# EasyEDA Pro project ProPrj_My_FOC_DRV8313_Share.epro

# Schematic Schematic2
Board Name: Board2; Create Date: 2024-11-29; Page Name: P1; Project Name: My_FOC_DRV8313; Schematic Name: Schematic2; Update Date: 2024-11-29; Company: 嘉立创EDA; Page Size: A3; Version: V1.0
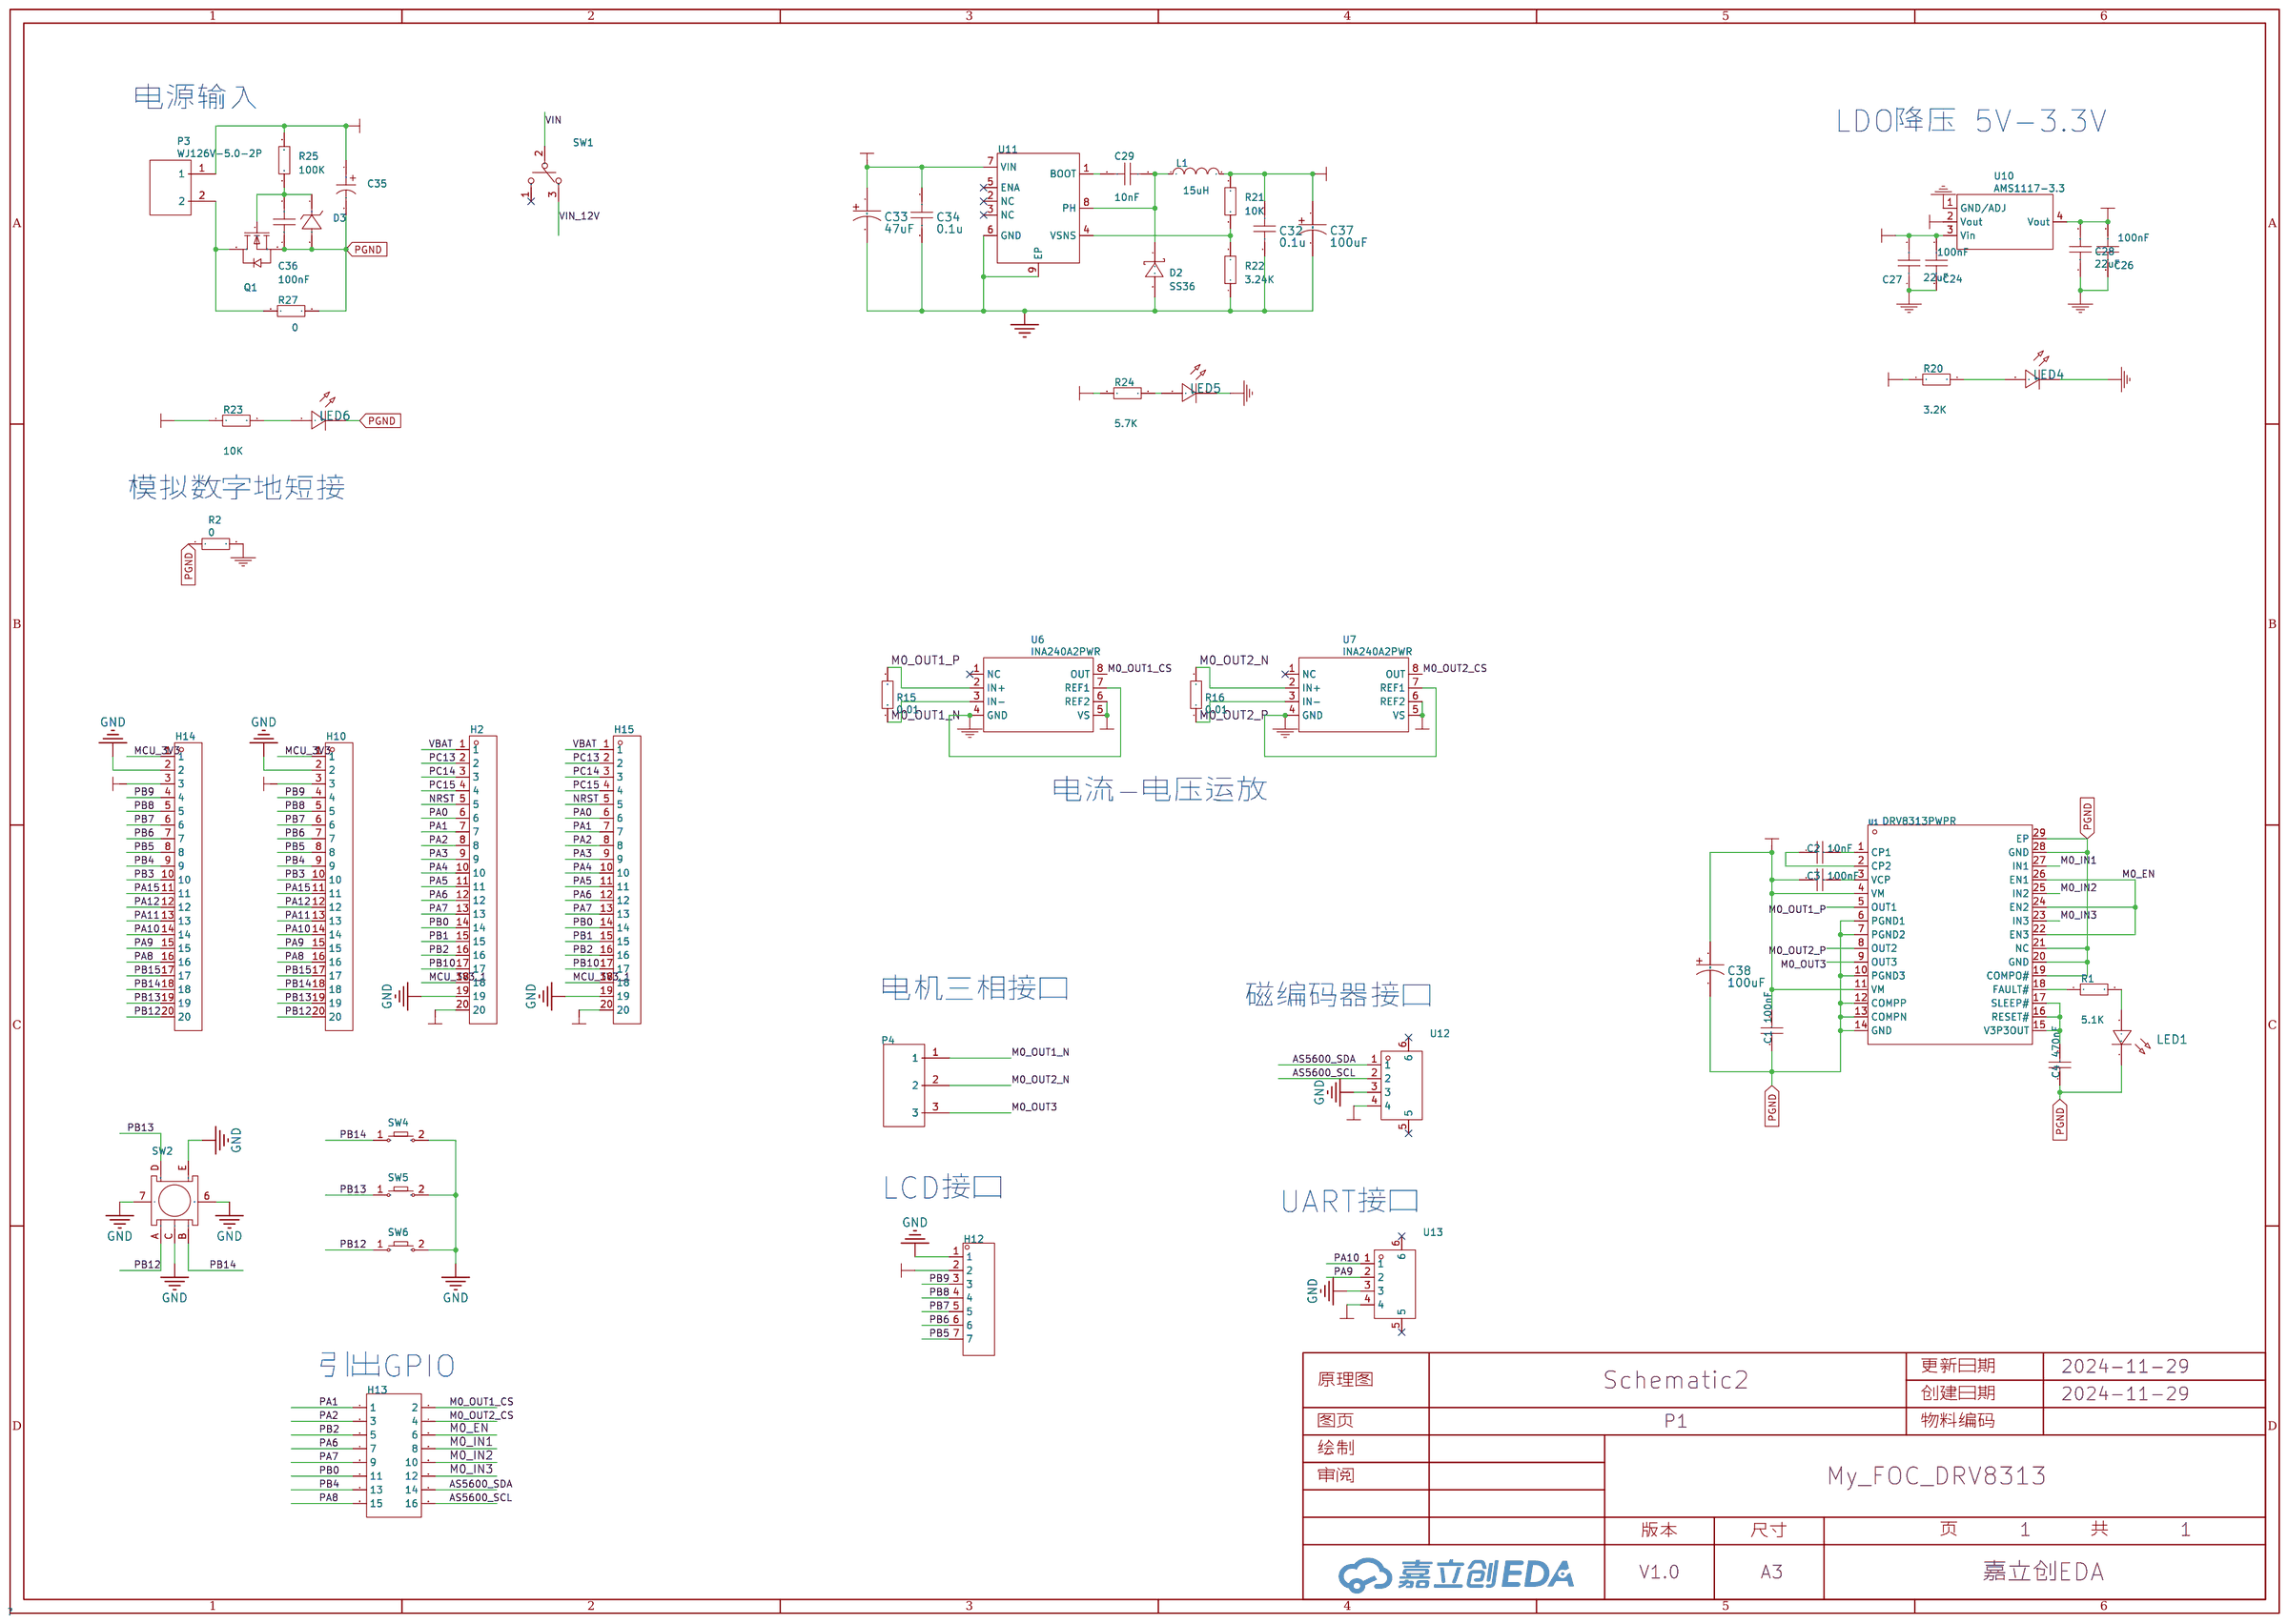
[diagram p0: schematic sheet]

## Parts
C1  100nF  [C0603]
C2  10nF  [C0603]
C3  100nF  [C0603]
C4  470nF  [C0603]
C24  100nF  [C0603]
C26  100nF  [C0603]
C27  22uF  [C0603]
C28  22uF  [C0603]
C29  10nF  [C0603]
C32  0.1u  [C0603]
C33  47uF  [CAP-SMD_BD5.0-L5.3-W5.3-FD]
C34  0.1u  [C0603]
C35  LZ1C471M0810  [CAP-SMD_BD8.0-L8.3-W8.3-LS9.3-FD-2]
C36  100nF  [C0603]
C37  100uF  [CAP-SMD_BD5.0-L5.3-W5.3-FD]
C38  100uF  [CAP-SMD_BD5.0-L5.3-W5.3-FD]
D2  SS36  [SMA_L4.3-W2.6-LS5.2-RD]
D3  ZMM12  [LL-34_L3.5-W1.5-RD]
H2  -  [HDR-TH_20P-P2.54-V-M-1]
H10  -  [HDR-TH_20P-P2.54-V-M-1]
H12  -  [HDR-TH_7P-P2.54-V-F]
H13  -  [HDR-TH_16P-P2.54-V-F-R2-C8-S2.54-1]
H14  -  [HDR-TH_20P-P2.54-V-M-1]
H15  -  [HDR-TH_20P-P2.54-V-M-1]
L1  15uH  [IND-SMD_L4.0-W4.0]
LED1  -  [LED_0603]
LED4  -  [LED_0603]
LED5  -  [LED_0603]
LED6  -  [LED_0603]
P3  WJ126V-5.0-2P  [conn-th_wj126v-5.0-2p]
P4  WJ126V-5.0-3P  [CONN-TH_3P-P5.00_WJ126V-5.0-3P]
Q1  AO3400A  [SOT-23-3_L2.9-W1.3-P1.90-LS2.4-BR]
R1  5.1K  [R0603]
R2  0  [R0805]
R15  0.01  [R1206]
R16  0.01  [R1206]
R20  3.2K  [R0603]
R21  10K  [R0603]
R22  3.24K  [R0603]
R23  10K  [R0603]
R24  5.7K  [R0603]
R25  100K  [R0603]
R27  0  [R0805]
SW1  MT-0-103-A101-M200-RS  [SW-TH_MT-0-103-A101-M200-RS]
SW2  EC11E15244G1  [SW-TH_EC11E15244G1]
SW4  -  [Key_SMD_3.6x6.1x2.5]
SW5  -  [Key_SMD_3.6x6.1x2.5]
SW6  -  [Key_SMD_3.6x6.1x2.5]
U1  DRV8313PWPR  [HTSSOP-28_L9.8-W4.5-P0.65-LS6.6-BL-EP]
U6  INA240A2PWR  [TSSOP-8_L4.4-W3.0-P0.65-LS6.4-BL]
U7  INA240A2PWR  [TSSOP-8_L4.4-W3.0-P0.65-LS6.4-BL]
U10  AMS1117-3.3  [SOT-223-3_L6.5-W3.4-P2.30-LS7.0-BR]
U11  TPS5430DDA  [ESOP-8_L4.9-W3.9-P1.27-LS6.0-BL-EP-2]
U12  XY-PH2.0-4A61  [CONN-SMD_4P-P2.00_XYECONN_XY-PH2.0-4A61]
U13  XY-PH2.0-4A61  [CONN-SMD_4P-P2.00_XYECONN_XY-PH2.0-4A61]

## Library data of the parts
C1 C3 = 0603B104K500NT: 容值:100nF;精度:±10%;额定电压:50V;材质(温度系数):X7R;; LCSC Part Name: 100nF ±10% 50V; Supplier Part: C30926; Manufacturer: FH(风华); Supplier Footprint: 0603; JLCPCB Part Class: Extended Part; Datasheet: https://atta.szlcsc.com/upload/public/pdf/source/20200305/C486355_26A10D38EF8C2A5C37091D0039909270.pdf; Supplier: LCSC; Tolerance: ±10%; Voltage Rated: 50V; Temperature Coefficient: X7R
C2 = CC0603KRX7R9BB103: 容值:10nF;精度:±10%;额定电压:50V;材质(温度系数):X7R;; LCSC Part Name: 10nF ±10% 50V; Supplier Part: C100042; Manufacturer: YAGEO(国巨); Supplier Footprint: 0603; JLCPCB Part Class: 扩展库; Datasheet: https://atta.szlcsc.com/upload/public/pdf/source/20181008/C309510_22F155564471FAF6A489F7D68F34234E.pdf; Supplier: LCSC; Tolerance: ±10%; Voltage Rated: 50V; Temperature Coefficient: X7R
C4 = CL10B474KA8NNNC: 容值:470nF;精度:±10%;额定电压:25V;材质(温度系数):X7R;; LCSC Part Name: 470nF ±10% 25V; Supplier Part: C1623; Manufacturer: SAMSUNG(三星); Supplier Footprint: 0603; JLCPCB Part Class: Basic Part; Datasheet: https://atta.szlcsc.com/upload/public/pdf/source/20160218/1457707763339.pdf; Supplier: LCSC; Tolerance: ±10%; Voltage Rated: 25V; Temperature Coefficient: X7R
C24 C26 = CC0603KRX7R9BB104: Supplier: LCSC; Manufacturer: YAGEO; Supplier Part: C14663; JLCPCB Part Class: Basic; JLCPCB SMD: Yes
C27 C28 = CL10A226MQ8NRNC: Supplier: LCSC; Manufacturer: SAMSUNG; Supplier Part: C59461; Paste Type: base
C29 C36 = CAP_0603: Supplier Footprint: 0603
C32 C34 = 0.1u
C33 C37 C38 = FVH016ADA470M0554: 容值:47uF;精度:±20%;额定电压:16V;; LCSC Part Name: 47uF ±20% 16V; Supplier Part: C7469972; Manufacturer: FOSAN(富信); Supplier Footprint: 5x5.4; JLCPCB Part Class: Extended Part; Datasheet: https://atta.szlcsc.com/upload/public/pdf/source/20230725/F0E937D26738F08AA89B969080CCF08D.pdf; Supplier: LCSC; Tolerance: ±20%; Rated Voltage: 16V; Operating Temperature: -55℃~+105℃
C35 = LZ1C471M0810: 容值: 470uF 精度: ±20% 额定电压: 16V 电容直径: 8mm 电容高度: 10.5mm 工作温度: 2000H@105℃贴片型铝电解电容; LCSC Part Name: 470uF ±20% 16V; Supplier Part: C22396804; Manufacturer: JARSON(伽盛); Supplier Footprint: SMD,8x10.5mm; JLCPCB Part Class: 扩展库; Datasheet: https://atta.szlcsc.com/upload/public/pdf/source/20240511/2B49156F673E82F822B79B11C5695630.pdf; Supplier: LCSC
D2 = SS36: Supplier: LCSC; Manufacturer: MDD; image: //image.lceda.cn/szlcsc/C16015.jpg; Supplier Part: C16015; Paste Type: expand
D3 = ZMM12_C707203: 稳压值(标称值):-;功率(Pd):500mW;; Supplier Part: C707203; Manufacturer: Slkor(萨科微); Supplier Footprint: LL-34; JLCPCB Part Class: 扩展库; Datasheet: https://atta.szlcsc.com/upload/public/pdf/source/20200721/C707184_776B95022AAA01ECB528B9CFDAFDB27C.pdf; Supplier: LCSC; Reverse Leakage Current (Ir): 100nA@9.1V; Power Dissipation: 500mW
H2 H10 H14 H15 = HDR-M_2.54_1x20P: 间距:2.54mm;总PIN位数:20;排数:1;插针结构:-;行距:-;安装类型:直插;圆针/方针:-;额定电流:-;额定电压:-;配合针长度:-;塑高:-;触头材质:黄铜;触头镀层:-;颜色:黑色;; Supplier Part: C50981; Supplier Footprint: 插件
H12 = HDR-F_2.54_1x7P: Supplier Part: C124418; Supplier Footprint: 插件
H13 = HDR-F_2.54_2x8: Supplier Part: C30734; Supplier Footprint: 插件
L1 = SWPA4018S100MT: 电感值:10uH;精度:±20%;额定电流:840mA;饱和电流(Isat):1.6A;类型:-;; LCSC Part Name: 10uH ±20% 1.6A; Supplier Part: C83442; Manufacturer: Sunlord(顺络); Supplier Footprint: SMD; JLCPCB Part Class: 扩展库; Datasheet: https://atta.szlcsc.com/upload/public/pdf/source/20231024/317626D2AA2F8AB4113C1875E432E6E1.pdf; Supplier: LCSC; Tolerance: ±20%; Rated Current: 840mA; Saturation Current (Isat): 1.6A; DC Resistance (DCR): 234mΩ
LED1 LED4-LED6 = LED_0603-R: Supplier Footprint: 0603
P3 = WJ126V-5.0-2P: Supplier: LCSC; Manufacturer: ReliaPro; Supplier Part: C8404; JLCPCB Part Class: Extended Part
P4 = WJ126V-5.0-3P: 结构:1x3P;间距:5mm;颜色:绿色;安装方式:直插;额定电流:18A;额定电压:250V;排数:1;线规 - AWG:14~26;线规 - 平方毫米:2.5;每排PIN数:3;工作温度范围:-40℃~+105℃;; LCSC Part Name: 5mm 1x3P 排数:1 每排P数:3 直插; Supplier Part: C8401; Manufacturer: KANGNEX(康奈克斯电气); Supplier Footprint: 插件,P=5mm; JLCPCB Part Class: 扩展库; Datasheet: https://atta.szlcsc.com/upload/public/pdf/source/20191225/C8401_BC4AEF85CCBF7CDF5CCE64583ADD1E63.pdf; Supplier: LCSC; Structure: 1x3P; Pitch: 5mm; Color: 绿色; Mounting Style: 直插; Current Rating (Max): 18A; Voltage Rating (Max): 250V; Number of Pins: 3P; Number of Rows: 1; Wire Gauge - AWG: 14~26; Wire Gauge - mm2: 2.5; Number of PINs Per Row: 3; Operating Temperature Range: -40℃~+105℃
Q1 = AO3400A_C347475: 类型:1个N沟道;漏源电压(Vdss):30V;连续漏极电流(Id):5.8A;导通电阻(RDS(on)@Vgs,Id):28mΩ@10V,5.8A;功率(Pd):1.4W;阈值电压(Vgs(th)@Id):1.4V@250uA;; LCSC Part Name: 1个N沟道 耐压:30V 电流:5.8A; Supplier Part: C347475; Manufacturer: UMW(友台半导体); Supplier Footprint: SOT-23; JLCPCB Part Class: 扩展库; Datasheet: https://atta.szlcsc.com/upload/public/pdf/source/20231109/50AB4FB4D66E55864F9B8D027B723C9A.pdf; Supplier: LCSC; Type: 1个N沟道; Drain Source Voltage (Vdss): 30V; Continuous Drain Current (Id): 5.8A; Drain Source On Resistance (RDS(on)@Vgs,Id): 28mΩ@10V,5.8A; Power Dissipation (Pd): 1.4W; Gate Threshold Voltage (Vgs(th)@Id): 1.4V@250uA; Total Gate Charge (Qg@Vgs): 12nC@10V; Input Capacitance (Ciss@Vds): 1.05nF@24V; Reverse Transfer Capacitance (Crss@Vds): 77pF@15V; Operating Temperature: -55℃~+150℃
R1 R20-R25 = Res_0603: Supplier Footprint: 0603
R2 = RM10FTN0: Supplier: LCSC; Supplier Part: C254574; Manufacturer: TA-I Tech
R15 R16 = RTT06R010FTP: Supplier: LCSC; Manufacturer: RALEC; Supplier Part: C104920
R27 = Res_0805: Supplier Footprint: 0805
SW1 = MT-0-103-A101-M200-RS: 电路结构:单刀双掷;机械寿命:-;额定电流:5A;额定电压(AC):125V;安装方式:直插;; LCSC Part Name: 小型钮子三脚三档 五件套 含配件; Supplier Part: C1788493; Manufacturer: YUEN FUNG(源丰); Supplier Footprint: 插件; JLCPCB Part Class: 扩展库; Datasheet: https://atta.szlcsc.com/upload/public/pdf/source/20230720/A7297B66510B798CA716A50870BE0E5B.pdf; Supplier: LCSC; Circuit: 单刀双掷; Switch Length: 13mm; Switch Width: 8mm; Switch Height: 28.6mm; Contact Current: 5A; Voltage Rating (AC): 125V; Actuator Type: 圆柱钮柄; Pin Style: 焊片; Mounting Style: 直插; Operating Temperature: -25℃~+85℃
SW2 = EC11E15244G1: LCSC Part Name: 编码器; Supplier Part: C370970; Manufacturer: ALPSALPINE(阿尔卑斯阿尔派); Supplier Footprint: 插件; JLCPCB Part Class: Extended Part; Datasheet: https://atta.szlcsc.com/upload/public/pdf/source/20190222/C370970_45D3DFC793E5CF6FACAF06DB9E7FAE9E.pdf; Supplier: LCSC
SW4-SW6 = Key_SMD_3.6x6.1x2.5: Supplier Footprint: SMD
U1 = DRV8313PWPR: 驱动电机类型:无刷直流BLDC;电源电压:8V~60V;输出电流:-;接口:并行;; LCSC Part Name: 无刷直流BLDC电机驱动芯片 60V; Supplier Part: C92482; Manufacturer: TI(德州仪器); Supplier Footprint: HTSSOP-28-EP-4.5mm; JLCPCB Part Class: 扩展库; Datasheet: https://www.ti.com/cn/lit/gpn/drv8313; Supplier: LCSC; Drive motor type: 无刷直流BLDC; Supply Voltage: 8V~60V; Interface: 并行; Operating Temperature: -40℃~+150℃@(Tj)
U6 U7 = INA240A2PWR: Supplier: LCSC; Manufacturer: TI; Supplier Part: C129949; Paste Type: expand
U10 = AMS1117-3.3: Supplier: LCSC; Manufacturer: AMS; image: //image.lceda.cn/szlcsc/C6186.jpg; Supplier Part: C6186; JLCPCB Part Class: Basic; JLCPCB SMD: Yes
U11 = TPS5430DDA: 功能类型:降压型;输出类型:可调;输入电压:5.5V~36V;输出电压:1.221V~32.04V;输出电流(最大值):3A;; LCSC Part Name: 降压 3A 36V; Supplier Part: C502477; Manufacturer: TI(德州仪器); Supplier Footprint: ESOP-8; JLCPCB Part Class: 扩展库; Datasheet: https://www.ti.com/cn/lit/gpn/tps5430; Supplier: LCSC; Function: 降压型; Output Type: 可调; Input Voltage: 5.5V~36V; Output Voltage: 1.221V~32.04V; Output Current (Max): 3A; Switching Frequency: 500kHz; Operating Temperature: -40℃~+125℃@(TJ); Synchronous Rectification: 否; Number of Outputs: 1; Topology: 降压式; Switch tube (built-in/external): 内置
U12 U13 = XY-PH2.0-4A61: 插针结构:1x4P;间距:2mm;安装方式:卧贴;总PIN数:4P;排数:1;每排PIN数:4;; LCSC Part Name: 间距:2.0mm 1x4P 卧贴; Supplier Part: C19272097; Manufacturer: XYECONN(辛译); Supplier Footprint: SMD,P=2mm,卧贴; JLCPCB Part Class: Extended Part; Datasheet: https://atta.szlcsc.com/upload/public/pdf/source/20231128/F1F74D25EE41EDF9A689EFC57C64BCC7.pdf; Supplier: LCSC; Pins Structure: 1x4P; Pitch: 2mm; Mounting Style: 卧贴; Number of Pins: 4P; Number of Rows: 1; Number of PINs Per Row: 4

## Nets
GND: C24.2 C26.2 C27.1 C28.1 C32.2 C33.2 C34.2 C37.2 D2.2(A) H2.19 H10.2 H12.1 H14.2 H15.19 LED4.1(C) LED5.1(C) R2.2 R22.1 SW2.6 SW2.7 SW2.C SW2.E SW4.2 SW5.2 SW6.2 U6.4(GND) U6.7(REF1) U7.4(GND) U7.7(REF1) U10.1(GND/ADJ) U11.6(GND) U11.9(EP) U12.3 U13.3
PGND: C1.1 C4.1 C35.2 C36.1 C38.2 D3.2(A) LED1.1(C) LED6.1(C) Q1.2(S) R2.1 R27.2 U1.6(PGND1) U1.7(PGND2) U1.10(PGND3) U1.12(COMPP) U1.13(COMPN) U1.14(GND) U1.19(COMPO#) U1.20(GND) U1.21(NC) U1.28(GND) U1.29(EP)
VBAT: H2.1 H15.1
VCC-3.3V: C26.1 C28.2 H12.2 R20.1 U6.5(VS) U6.6(REF2) U7.5(VS) U7.6(REF2) U10.2(Vout) U10.4(Vout) U12.4 U13.4
VCC-5V: C24.1 C27.2 C32.1 C37.1 H10.3 H14.3 L1.2 R21.2 R24.1 U10.3(Vin)
VIN: C1.2 C3.1 C33.1 C34.1 C38.1 R23.1 SW1.2 U1.4(VM) U1.11(VM) U11.7(VIN)
VIN_12V: C35.1 P3.1 R25.2 SW1.3
AS5600_SCL: H13.16 U12.2
AS5600_SDA: H13.14 U12.1
M0_EN: H13.6 U1.22(EN3) U1.24(EN2) U1.26(EN1)
M0_IN1: H13.8 U1.27(IN1)
M0_IN2: H13.10 U1.25(IN2)
M0_IN3: H13.12 U1.23(IN3)
M0_OUT1_CS: H13.2 U6.8(OUT)
M0_OUT1_N: P4.1 R15.1 U6.3(IN-)
M0_OUT1_P: R15.2 U1.5(OUT1) U6.2(IN+)
M0_OUT2_CS: H13.4 U7.8(OUT)
M0_OUT2_N: P4.2 R16.2 U7.2(IN+)
M0_OUT2_P: R16.1 U1.8(OUT2) U7.3(IN-)
M0_OUT3: P4.3 U1.9(OUT3)
MCU_3V3: H10.1 H14.1
MCU_3V3_1: H2.18 H15.18
MCU_5V: H2.20 H15.20
NRST: H2.5 H15.5
PA0: H2.6 H15.6
PA1: H2.7 H13.1 H15.7
PA2: H2.8 H13.3 H15.8
PA3: H2.9 H15.9
PA4: H2.10 H15.10
PA5: H2.11 H15.11
PA6: H2.12 H13.7 H15.12
PA7: H2.13 H13.9 H15.13
PA8: H10.16 H13.15 H14.16
PA9: H10.15 H14.15 U13.2
PA10: H10.14 H14.14 U13.1
PA11: H10.13 H14.13
PA12: H10.12 H14.12
PA15: H10.11 H14.11
PB0: H2.14 H13.11 H15.14
PB1: H2.15 H15.15
PB2: H2.16 H13.5 H15.16
PB3: H10.10 H14.10
PB4: H10.9 H13.13 H14.9
PB5: H10.8 H12.7 H14.8
PB6: H10.7 H12.6 H14.7
PB7: H10.6 H12.5 H14.6
PB8: H10.5 H12.4 H14.5
PB9: H10.4 H12.3 H14.4
PB10: H2.17 H15.17
PB12: H10.20 H14.20 SW2.A SW6.1
PB13: H10.19 H14.19 SW2.D SW5.1
PB14: H10.18 H14.18 SW2.B SW4.1
PB15: H10.17 H14.17
PC13: H2.2 H15.2
PC14: H2.3 H15.3
PC15: H2.4 H15.4
$1N2058: C4.2 U1.15(V3P3OUT) U1.16(RESET#) U1.17(SLEEP#)
$1N2061: C2.2 U1.1(CP1)
$1N2062: C2.1 U1.2(CP2)
$1N2063: C3.2 U1.3(VCP)
$1N2072: R1.1 U1.18(FAULT#)
$1N2073: LED1.2(A) R1.2
$1N2080: LED4.2(A) R20.2
$1N2087: C29.1 U11.1(BOOT)
$1N2088: R21.1 R22.2 U11.4(VSNS)
$1N2090: P3.2 Q1.3(D) R27.1
$1N2099: LED6.2(A) R23.2
$1N2103: LED5.2(A) R24.2
$1N2889: C29.2 D2.1(K) L1.1 U11.8(PH)
$1N3381: C36.2 D3.1(K) Q1.1(G) R25.1

Not connected (* = marked no-connect by the designer): SW1 1*; U6 1(NC)*; U7 1(NC)*; U11 2(NC)* 3(NC)* 5(ENA)*; U12 5* 6*; U13 5* 6*

## Notes on the sheet
- 电源输入
- LDO降压 5V-3.3V
- 模拟数字地短接
- 电流-电压运放
- 电机三相接口
- 磁编码器接口
- LCD接口
- UART接口
- 引出GPIO

# Board PCB2
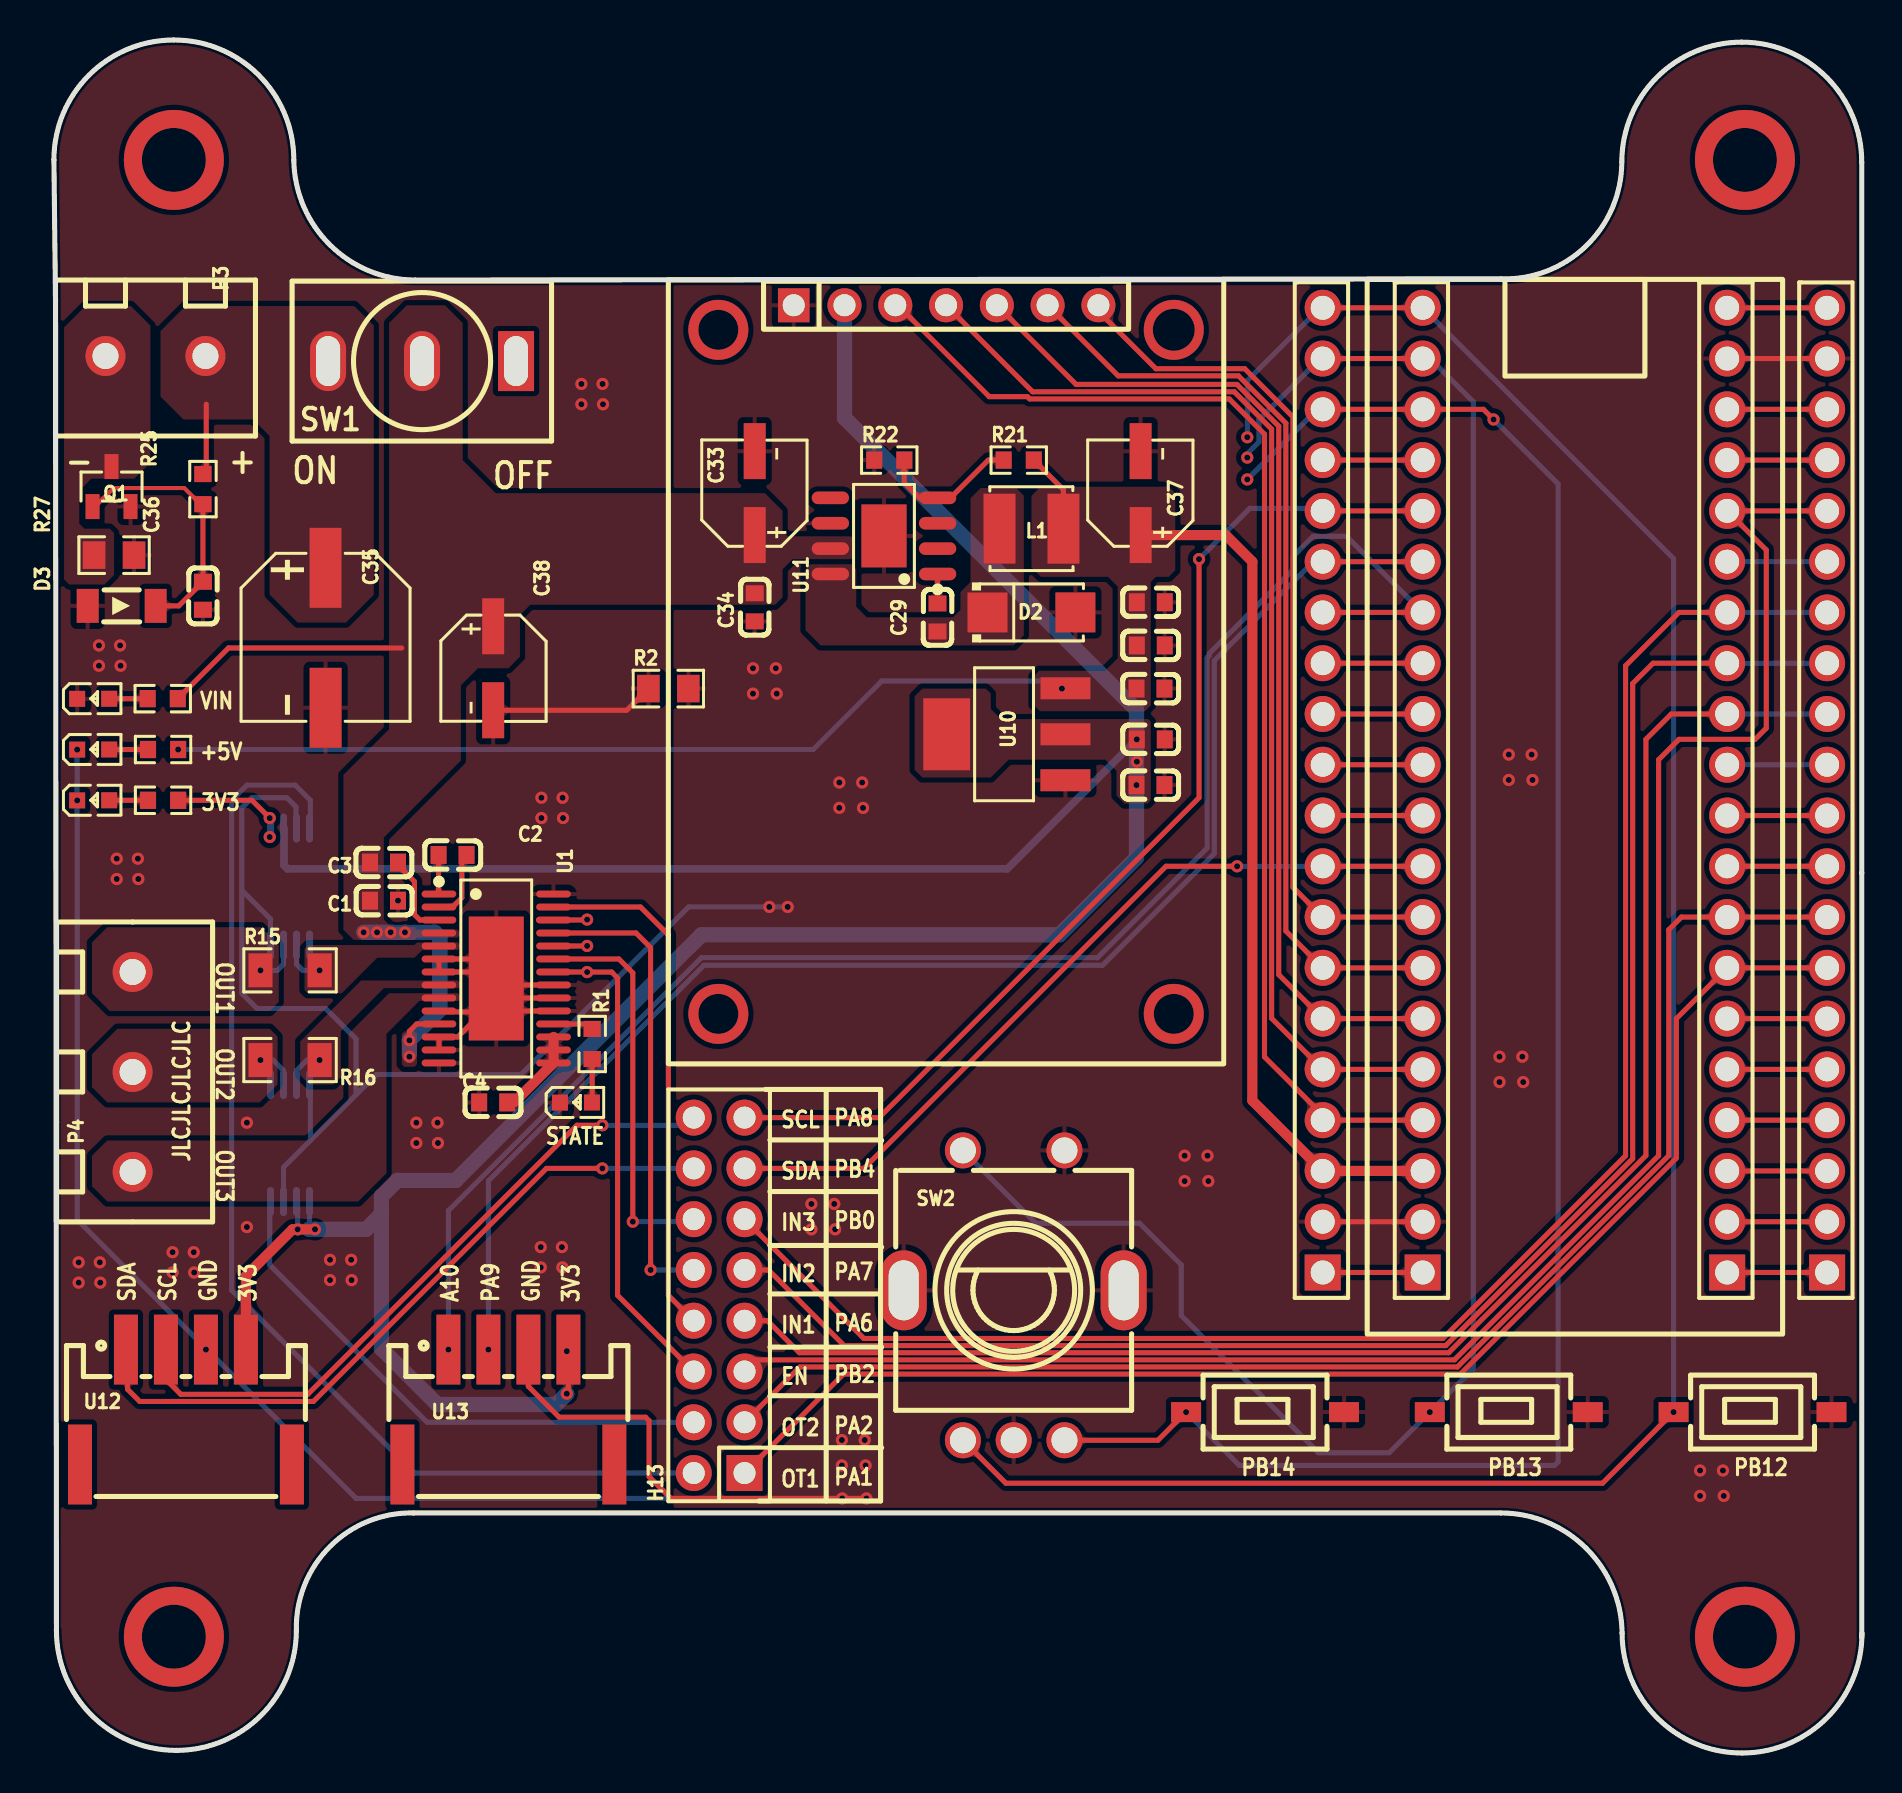
[diagram p1: board, top side]
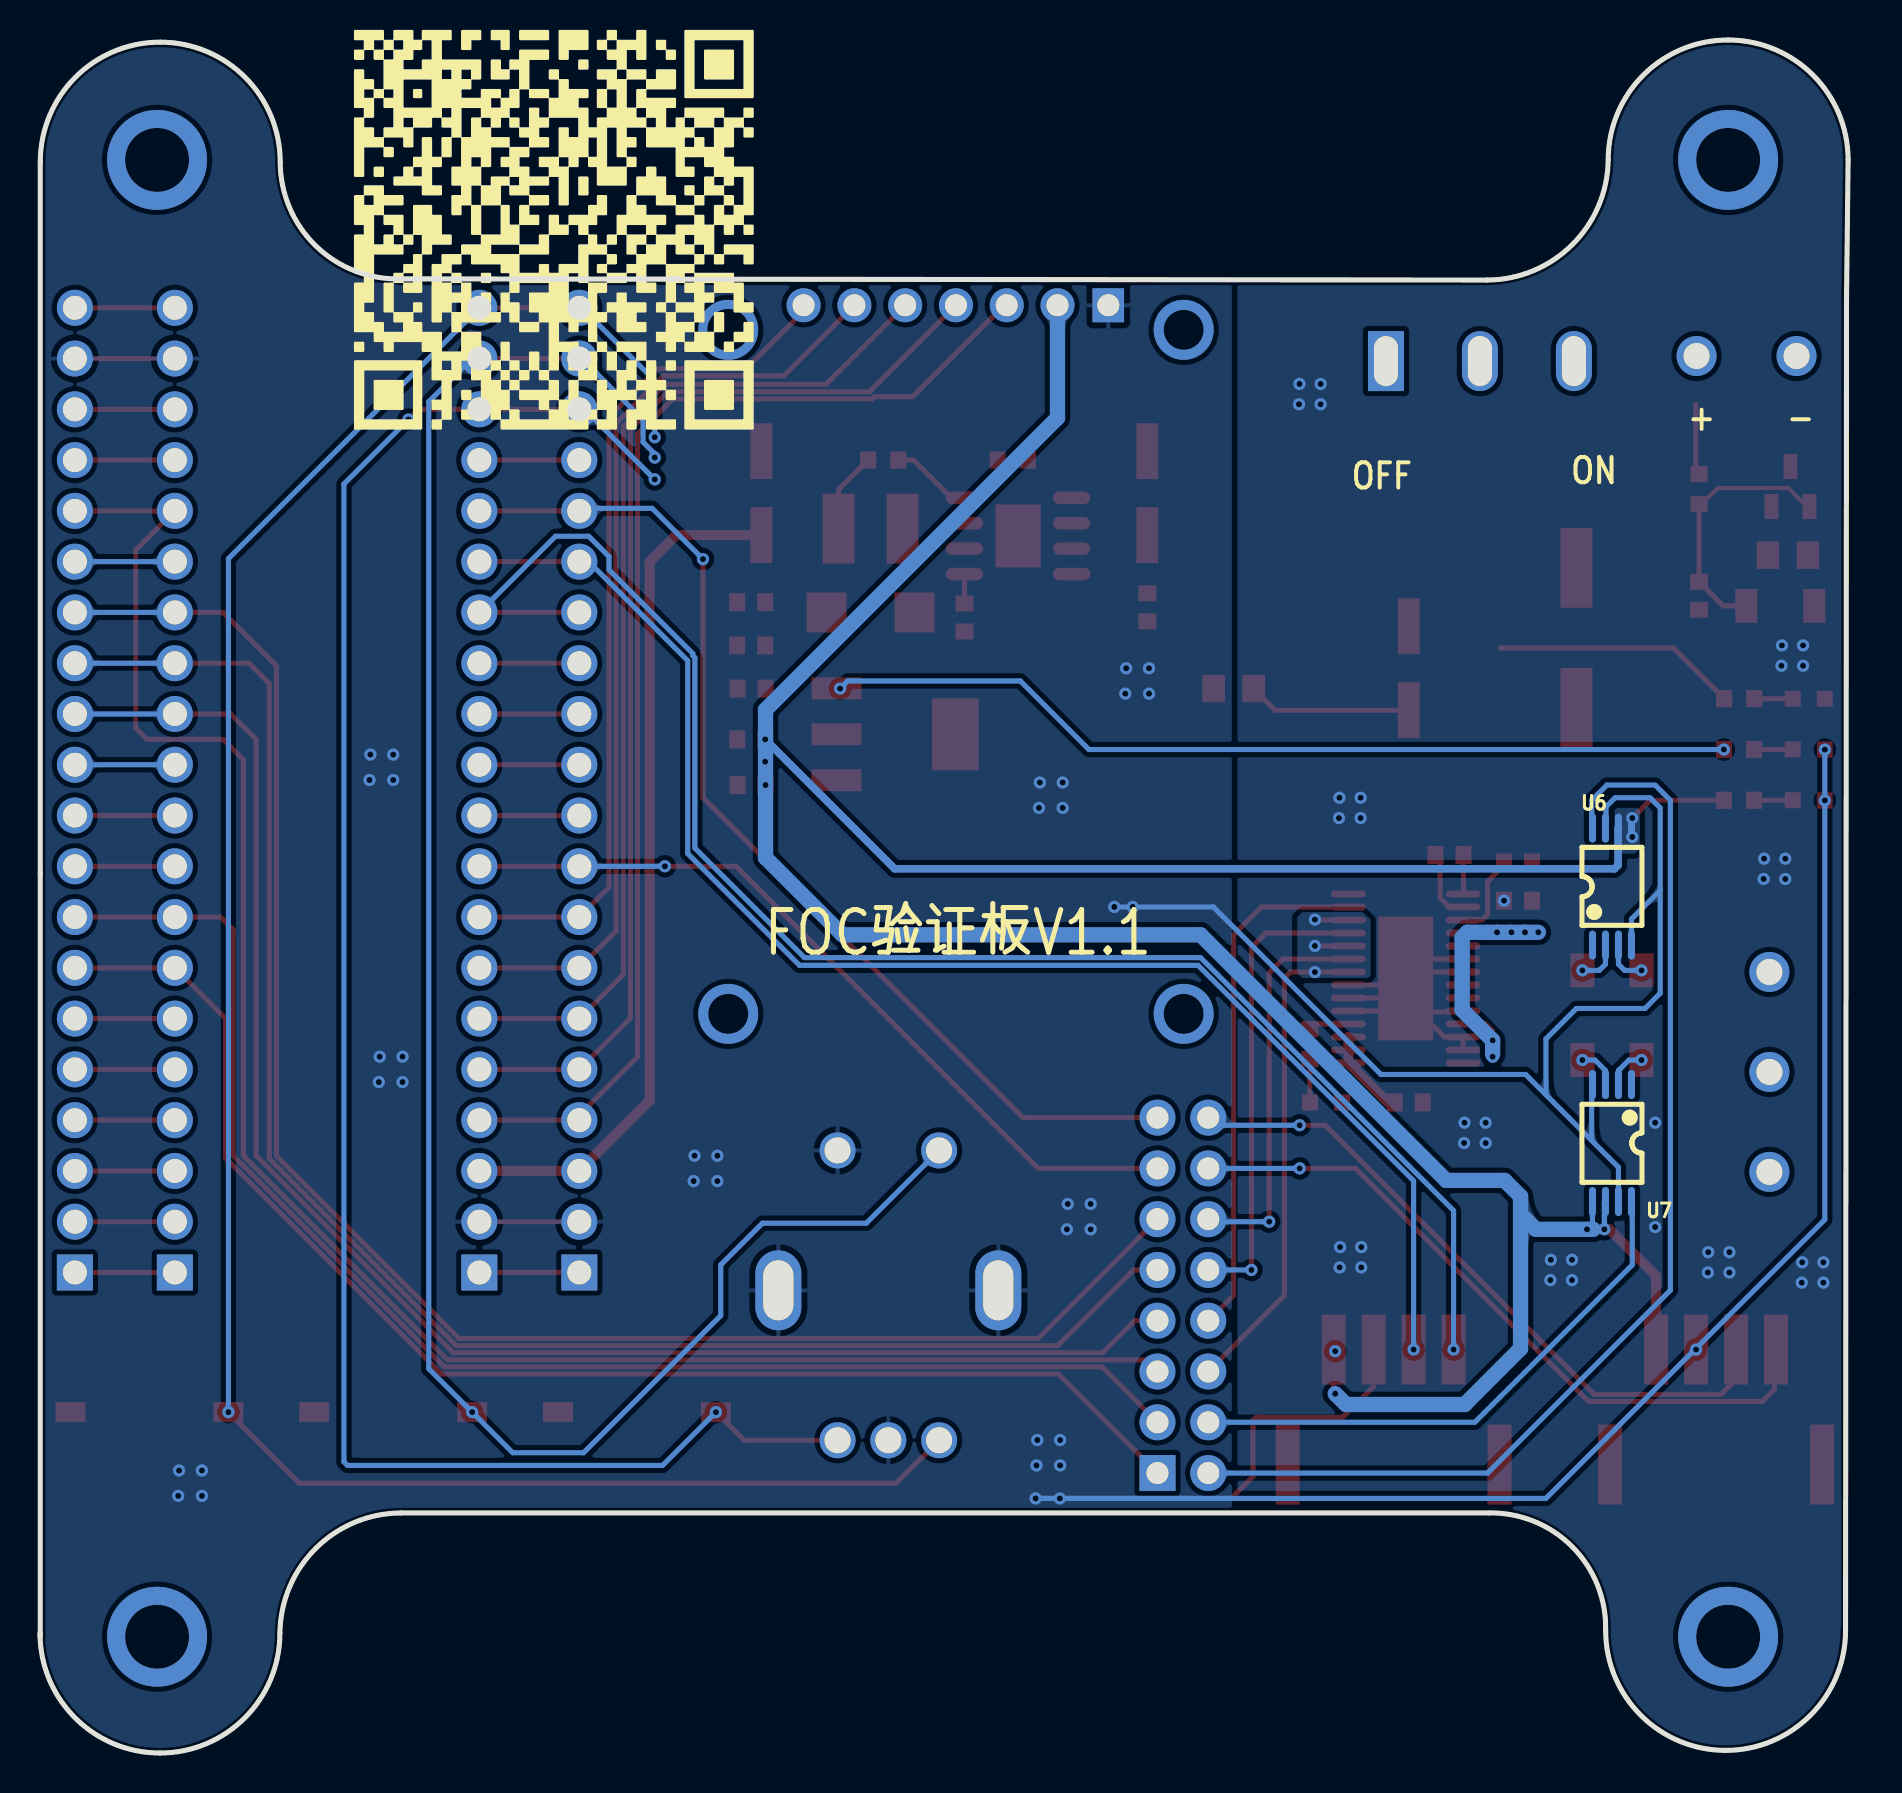
[diagram p2: board, bottom side, seen from below]

Outline 90.44 x 85.7 mm; copper layers: Top Layer, Bottom Layer. Coordinates in mm from the lower left corner of the outline.
Outline path: 90.42,5.78 90.42,79.59 arc(88.67,83.83) 84.42,85.59 arc(80.18,83.83) 78.42,79.59 arc(76.64,75.39) 72.39,73.75 18.06,73.69 arc(13.8,75.45) 12,79.7 arc(10.24,83.94) 6,85.7 arc(1.76,83.94) 0,79.7 0.08,72.67 0.13,6.13 arc(1.88,1.89) 6.13,0.13 arc(10.37,1.89) 12.13,6.13 arc(13.8,10.32) 17.99,12.01 72.38,12.01 arc(76.64,10.25) 78.44,6 arc(80.2,1.76) 84.44,0 arc(88.68,1.76) 90.44,6
Stack: Top Layer 0.035mm / Dielectric1 1.51mm FR4 er 4.5 / Bottom Layer 0.035mm

## Design rules (mm)
template: 自定义配置
spacing copperThickness1oz (default): track to track 0.102, other pairs 0.152 to 0.3
spacing copperThickness2oz: track to track 0.203, other pairs 0.152 to 0.3
track width copperThickness1oz (default): min 0.127, default 0.254, max 2.54
track width copperThickness2oz: min 0.203, default 0.254, max 2.54
differential pair differentialPair (default): width min 0.127, default 0.254, max 2.54; gap min 0.152, default 0.152
via viaSize (default): diameter min 0.5, default 0.61, max 10; hole min 0.3, default 0.305, max 6.3

## Placement (name value [footprint] x y rotation side)
C1  100nF  [C0603]  16.51 42.64 180 top
C2  10nF  [C0603]  19.94 44.93 180 top
C3  100nF  [C0603]  16.51 44.55 0 top
C4  470nF  [C0603]  21.97 32.55 0 top
C24  100nF  [C0603]  54.86 55.41 0 top
C26  100nF  [C0603]  54.86 50.71 0 top
C27  22uF  [C0603]  54.85 53.25 180 top
C28  22uF  [C0603]  54.85 48.42 180 top
C29  10nF  [C0603]  44.2 56.8 270 top
C32  0.1u  [C0603]  54.86 57.57 0 top
C33  47uF  [CAP-SMD_BD5.0-L5.3-W5.3-FD]  35.05 63.03 90 top
C34  0.1u  [C0603]  35.05 57.31 270 top
C35  LZ1C471M0810  [CAP-SMD_BD8.0-L8.3-W8.3-LS9.3-FD-2]  13.59 55.79 270 top
C36  100nF  [C0603]  7.45 57.89 90 top
C37  100uF  [CAP-SMD_BD5.0-L5.3-W5.3-FD]  54.36 63.03 90 top
C38  100uF  [CAP-SMD_BD5.0-L5.3-W5.3-FD]  21.97 54.27 270 top
D2  SS36  [SMA_L4.3-W2.6-LS5.2-RD]  48.9 57.06 0 top
D3  ZMM12  [LL-34_L3.5-W1.5-RD]  3.39 57.39 180 top
H2  -  [HDR-TH_20P-P2.54-V-M-1]  83.69 48.17 90 top
H10  -  [HDR-TH_20P-P2.54-V-M-1]  68.46 48.17 90 top
H12  -  [HDR-TH_7P-P2.54-V-F]  44.62 72.43 0 top
H13  -  [HDR-TH_16P-P2.54-V-F-R2-C8-S2.54-1]  33.27 22.9 90 top
H14  -  [HDR-TH_20P-P2.54-V-M-1]  63.46 48.17 90 top
H15  -  [HDR-TH_20P-P2.54-V-M-1]  88.69 48.17 90 top
L1  15uH  [IND-SMD_L4.0-W4.0]  48.9 61.25 0 top
LED1  -  [LED_0603]  26.16 32.55 0 top
LED4  -  [LED_0603]  2.02 47.67 0 top
LED5  -  [LED_0603]  2.02 50.21 0 top
LED6  -  [LED_0603]  2.02 52.75 0 top
P3  WJ126V-5.0-2P  [conn-th_wj126v-5.0-2p]  5.08 69.89 270 top
P4  WJ126V-5.0-3P  [CONN-TH_3P-P5.00_WJ126V-5.0-3P]  3.94 34.07 90 top
Q1  AO3400A  [SOT-23-3_L2.9-W1.3-P1.90-LS2.4-BR]  2.88 63.36 270 top
R1  5.1K  [R0603]  26.92 35.47 270 top
R2  0  [R0805]  30.73 53.25 0 top
R15  0.01  [R1206]  11.81 39.15 0 top
R16  0.01  [R1206]  11.81 34.67 180 top
R20  3.2K  [R0603]  5.46 47.66 180 top
R21  10K  [R0603]  48.26 64.68 0 top
R22  3.24K  [R0603]  41.78 64.68 0 top
R23  10K  [R0603]  5.44 52.75 180 top
R24  5.7K  [R0603]  5.46 50.2 180 top
R25  100K  [R0603]  7.45 63.23 90 top
R27  0  [R0805]  3.01 59.93 0 top
SW1  MT-0-103-A101-M200-RS  [SW-TH_MT-0-103-A101-M200-RS]  18.42 69.63 180 top
SW2  EC11E15244G1  [SW-TH_EC11E15244G1]  48.01 22.9 0 top
SW4  -  [Key_SMD_3.6x6.1x2.5]  60.58 17.05 0 top
SW5  -  [Key_SMD_3.6x6.1x2.5]  72.77 17.05 0 top
SW6  -  [Key_SMD_3.6x6.1x2.5]  84.96 17.05 0 top
U1  DRV8313PWPR  [HTSSOP-28_L9.8-W4.5-P0.65-LS6.6-BL-EP]  22.13 38.75 270 top
U6  INA240A2PWR  [TSSOP-8_L4.4-W3.0-P0.65-LS6.4-BL]  11.81 43.34 180 bottom
U7  INA240A2PWR  [TSSOP-8_L4.4-W3.0-P0.65-LS6.4-BL]  11.81 30.52 0 bottom
U10  AMS1117-3.3  [SOT-223-3_L6.5-W3.4-P2.30-LS7.0-BR]  47.62 50.96 0 top
U11  TPS5430DDA  [ESOP-8_L4.9-W3.9-P1.27-LS6.0-BL-EP-2]  41.52 60.89 90 top
U12  XY-PH2.0-4A61  [CONN-SMD_4P-P2.00_XYECONN_XY-PH2.0-4A61]  6.6 17.31 0 top
U13  XY-PH2.0-4A61  [CONN-SMD_4P-P2.00_XYECONN_XY-PH2.0-4A61]  22.73 17.31 0 top

## Footprints (pads in the part's own frame, mm; a bottom-side part is the same pattern mirrored in y, then rotated)
C0603
  rect 0.8x0.9 smd: 1(-0.7,0) 2(0.7,0)
CAP-SMD_BD5.0-L5.3-W5.3-FD
  rect 2.8x1.1 smd: 1(-2.1,0) 2(2.1,0)
CAP-SMD_BD8.0-L8.3-W8.3-LS9.3-FD-2
  rect 4x1.6 smd: 1(-3.5,0) 2(3.5,0)
CONN-SMD_4P-P2.00_XYECONN_XY-PH2.0-4A61
  rect 1.2x3.5 smd: 1(-3,2.875) 2(-1,2.875) 3(1,2.875) 4(3,2.875)
  rect 1.2x4 smd: 5(5.3,-2.875) 6(-5.3,-2.875)
CONN-TH_3P-P5.00_WJ126V-5.0-3P
  round 2 hole 1.3: 1(5,0) 2(-0.002,0) 3(-5,0)
conn-th_wj126v-5.0-2p
  round 2 hole 1.3: 1(0,2.501) 2(0,-2.501)
ESOP-8_L4.9-W3.9-P1.27-LS6.0-BL-EP-2
  oval 0.63x1.865 smd: 1(-1.905,-2.683) 2(-0.635,-2.683) 3(0.635,-2.683) 4(1.905,-2.683) 5(1.905,2.683) 6(0.635,2.683) 7(-0.635,2.683) 8(-1.905,2.683)
  rect 3.15x2.26 smd: 9(0,0)
HDR-TH_7P-P2.54-V-F
  rect 1.575x1.7 hole 1.1: 1(-7.62,0)
  round 1.7 hole 1.1: 2(-5.08,0) 3(-2.54,0) 4(0,0) 5(2.54,0) 6(5.08,0) 7(7.62,0)
HDR-TH_16P-P2.54-V-F-R2-C8-S2.54-1
  rect 1.8x1.8 hole 1.1: 1(-8.89,-1.27)
  round 1.8 hole 1.1: 2(-8.89,1.27) 3(-6.35,-1.27) 4(-6.35,1.27) 5(-3.81,-1.27) 6(-3.81,1.27) 7(-1.27,-1.27) 8(-1.27,1.27) 9(1.27,-1.27) 10(1.27,1.27) 11(3.81,-1.27) 12(3.81,1.27) 13(6.35,-1.27) 14(6.35,1.27) 15(8.89,-1.27) 16(8.89,1.27)
HDR-TH_20P-P2.54-V-M-1
  rect 1.801x1.801 hole 1.199: 1(-24.13,0)
  round 1.801 hole 1.199: 2(-21.59,0) 3(-19.05,0) 4(-16.51,0) 5(-13.97,0) 6(-11.43,0) 7(-8.89,0) 8(-6.35,0) 9(-3.81,0) 10(-1.27,0) 11(1.27,0) 12(3.81,0) 13(6.35,0) 14(8.89,0) 15(11.43,0) 16(13.97,0) 17(16.51,0) 18(19.05,0) 19(21.59,0) 20(24.13,0)
HTSSOP-28_L9.8-W4.5-P0.65-LS6.6-BL-EP
  oval 0.343x1.732 smd: 1(-4.225,-2.866) 2(-3.575,-2.866) 3(-2.925,-2.866) 4(-2.275,-2.866) 5(-1.625,-2.866) 6(-0.975,-2.866) 7(-0.325,-2.866) 8(0.325,-2.866) 9(0.975,-2.866) 10(1.625,-2.866) 11(2.275,-2.866) 12(2.925,-2.866) 13(3.575,-2.866) 14(4.225,-2.866) 15(4.225,2.866) 16(3.575,2.866) 17(2.925,2.866) 18(2.275,2.866) 19(1.625,2.866) 20(0.975,2.866) 21(0.325,2.866) 22(-0.325,2.866) 23(-0.975,2.866) 24(-1.625,2.866) 25(-2.275,2.866) 26(-2.925,2.866) 27(-3.575,2.866) 28(-4.225,2.866)
  rect 6.2x2.75 smd: 29(0,0)
IND-SMD_L4.0-W4.0
  rect 1.6x3.5 smd: 1(-1.6,0) 2(1.6,0)
Key_SMD_3.6x6.1x2.5
  rect 1.501x1.001 smd: 1(-3.95,0) 2(3.95,0)
LED_0603
  rect 0.8x0.8 smd: 1(-0.851,-0.01) 2(0.75,-0.005)
LL-34_L3.5-W1.5-RD
  rect 1.1x1.7 smd: 1(-1.7,0) 2(1.7,0)
R0603
  rect 0.806x0.864 smd: 1(-0.753,0) 2(0.753,0)
R0805
  rect 1.133x1.377 smd: 1(-1,0) 2(1,0)
R1206
  rect 1.208x1.701 smd: 1(-1.479,0) 2(1.479,0)
SMA_L4.3-W2.6-LS5.2-RD
  rect 2x2 smd: 1(-2.2,0) 2(2.2,0)
SOT-23-3_L2.9-W1.3-P1.90-LS2.4-BR
  rect 1.25x0.7 smd: 1(1,-0.95) 2(1,0.95) 3(-1,0)
SOT-223-3_L6.5-W3.4-P2.30-LS7.0-BR
  rect 2.5x1.1 smd: 1(2.97,-2.3) 2(2.97,0) 3(2.97,2.3)
  rect 2.34x3.6 smd: 4(-2.97,0)
SW-TH_EC11E15244G1
  oval 2.3x4 hole 1.5x3: 6(5.5,0.25) 7(-5.5,0.25)
  round 1.8 hole 1.3: A(-2.54,-7.25) B(2.54,-7.25) C(0,-7.25) D(-2.54,7.25) E(2.54,7.25)
SW-TH_MT-0-103-A101-M200-RS
  rect 1.8x3 hole 1.2x2.5: 1(-4.7,0)
  oval 1.8x3 hole 1.2x2.5: 2(0,0) 3(4.7,0)
TSSOP-8_L4.4-W3.0-P0.65-LS6.4-BL
  oval 0.353x1.454 smd: 1(-0.975,-2.927) 2(-0.325,-2.927) 3(0.325,-2.927) 4(0.975,-2.927) 5(0.975,2.927) 6(0.325,2.927) 7(-0.325,2.927) 8(-0.975,2.927)

## Nets
As in the schematic.

Pads without a net: SW1 1; U6 1; U7 1; U11 2 3 5; U12 5 6; U13 5 6

## Via types
v1: diameter 5, hole 3.2, Top Layer to Bottom Layer, 4 vias
v2: diameter 3, hole 2, Top Layer to Bottom Layer, 3 vias
v3: diameter 3, hole 2.1, Top Layer to Bottom Layer, 1 via
v4: diameter 0.61, hole 0.305, Top Layer to Bottom Layer, 117 vias

## Routing (per net, layer and track width the routed paths; a pad name or vN(x,y) marks a point on that pad's centre or on a via; arc(x,y) is an arc through that point)
GND: length 162.9
  Top Layer w0.254: U13.3 23.73,18.34 25.27,16.8 29.59,16.8 29.77,16.62 29.77,13.83 30.86,12.74 v4(39.43,12.74) v4(40.64,12.74) ; H2.19 H15.19 ; H10.2 H14.2
  Bottom Layer w0.254: 9.4,43.16 10.84,41.72 U6.4 ; 9.4,43.16 9.4,38.01 10.16,37.25 13.59,37.25 15.11,35.72 15.11,32.93 ; 9.4,43.16 9.4,47.28 9.91,47.79 11.65,47.79 12.11,47.33 12.11,46.3 U6.7 ; 12.83,30.64 12.83,33.4 U7.4 ; 12.83,30.64 15.11,32.93 ; 12.83,30.64 11.49,29.3 U7.7 ; v4(1.16,50.2) v4(1.16,47.65) 1.16,26.68 15.11,12.74 v4(39.43,12.74) v4(40.64,12.74) ; 15.11,32.93 16.13,33.94 23.37,33.94 31.75,42.33 v4(35.78,42.33) v4(36.7,42.33)
  vias: v4(7.6,20.18) v4(34.97,54.27) v4(34.97,53) v4(36.11,54.27) v4(36.15,53) v4(37.89,27.47) v4(37.89,26.2) v4(39.03,27.47) v4(39.07,26.2) v4(39.28,48.55) v4(39.28,47.28) v4(39.41,15.66) v4(39.41,14.39) v4(40.43,48.55) v4(40.47,47.28) v4(40.56,15.66) v4(40.6,14.39) v4(56.56,29.88) v4(56.56,28.61) v4(57.7,29.88) v4(57.74,28.61) v4(72.31,34.83) v4(72.31,33.56) v4(72.77,49.95) v4(72.77,48.68) v4(73.45,34.83) v4(73.49,33.56) v4(73.91,49.95) v4(73.96,48.68) v4(82.34,14.13) v4(82.34,12.86) v4(83.48,14.13) v4(83.52,12.86)
PGND: length 27.3
  Top Layer w0.254: R2.1 28.65,52.16 21.97,52.16 ; 22.63,37.25 22.75,37.12 U1.19 ; U1.20 23.1,37.77 22.63,38.25 22.8,38.42 24.99,38.42 ; 21.63,37.25 21.45,37.07 ; 21.45,37.07 19.26,37.07 ; 21.45,37.07 20.2,35.82 U1.12 U1.13 ; 21.63,38.25 20.8,39.07 U1.7 U1.6 21.15,39.72 21.63,39.25
  vias: v4(1.24,24.55) v4(1.24,23.53) v4(2.25,55.41) v4(2.25,54.39) v4(2.3,24.55) v4(2.32,23.53) v4(3.14,44.74) v4(3.14,43.72) v4(3.31,55.41) v4(3.33,54.39) v4(4.2,44.74) v4(4.22,43.72) v4(5.94,25.05) v4(5.94,24.04) v4(7,25.05) v4(7.02,24.04) v4(9.65,31.53) v4(9.65,26.31) v4(13.81,24.67) v4(13.81,23.66) v4(14.87,24.67) v4(14.89,23.66) v4(17.21,42.64) v4(18.13,31.53) v4(18.13,30.52) v4(19.19,31.53) v4(19.21,30.52) v4(24.38,47.79) v4(24.38,46.77) v4(24.35,25.31) v4(24.35,24.29) v4(25.44,47.79) v4(25.41,25.31) v4(25.43,24.29) v4(25.47,46.77) v4(26.38,68.49) v4(26.38,67.47) v4(27.44,68.49) v4(27.46,67.47)
VBAT: length 5
  Top Layer w0.254: H2.1 H15.1
VCC-3.3V: length 166.1
  Top Layer w0.254: R20.1 9.91,47.66 v4(10.8,46.77) ; v4(25.65,17.97) 25.73,18.05 U13.4
  Top Layer w0.508: U12.4 9.6,23.86 11.94,26.2 v4(13.06,26.2)
  Bottom Layer w0.254: v4(12.19,26.2) 12.19,27.53 U7.6 ; 12.75,26.2 12.79,26.23 U7.5
  Bottom Layer w0.381: U6.6 11.5,46.25 11.5,44.41 11.68,44.23 47.69,44.23 54.15,50.69
  Bottom Layer w0.762: v4(25.65,17.97) 25.11,17.44 19.18,17.44 16.38,20.23 16.38,26.96 ; H12.2 39.54,66.79 54.15,52.19 v4(54.15,48.42) 54.15,44.79 50.29,40.93 32.38,40.93 20.1,28.64 17.18,28.64 16.38,27.85 16.38,26.96 ; 16.38,26.96 15.62,26.2 v4(13.06,26.2) 12.75,26.2
  vias: v4(10.8,45.82) v4(25.65,20.1) v4(54.16,50.71) v4(54.17,49.59)
VCC-5V: length 92.9
  Top Layer w0.254: L1.2 50.5,63.2 R21.2
  Top Layer w0.508: C37.1 58.62,60.93 59.94,59.6 59.94,32.64 H14.3 H10.3
  Bottom Layer w0.254: v4(6.21,50.2) 37.97,50.2 41.4,53.63 50.04,53.63 v4(50.42,53.25)
VIN: length 24.7
  Top Layer w0.254: U1.11 18.15,36.47 17.78,36.1 v4(17.78,35.65) ; R23.1 8.73,55.28 17.4,55.28
  Bottom Layer w0.762: 17.78,34.96 v4(17.78,35.65) 19.3,37.17 19.3,40.8 19.05,41.06 v4(17.56,41.06) v4(16.84,41.06) v4(16.16,41.06) v4(15.49,41.06)
  vias: v4(17.78,34.83)
VIN_12V: length 3.6
  Top Layer w0.254: 7.62,67.47 7.62,64.15 7.45,63.98
(no net):
  vias: v1(6,79.7) v1(6,5.82) v1(84.58,79.7) v1(84.58,5.82) v2(33.23,71.2) v2(33.23,36.98) v2(56.01,36.98) v3(56.01,71.2)
AS5600_SCL: length 33.2
  Top Layer w0.254: v4(27.43,31.41) 26.16,31.41 12.7,17.94 6.35,17.94 5.59,18.7 5.59,19.44
  Bottom Layer w0.254: v4(27.43,31.41) 31.62,31.41 H13.16
AS5600_SDA: length 35.4
  Top Layer w0.254: v4(27.43,29.25) 24.64,29.25 12.98,17.59 4.29,17.59 3.68,18.2 3.68,20.1 U12.1
  Bottom Layer w0.254: v4(27.43,29.25) H13.14
M0_EN: length 28.7
  Top Layer w0.254: 24.24,41.67 U1.26 26.65,41.67 v4(26.67,41.69) ; v4(26.67,40.38) 26.67,40.37 U1.24 ; H13.6 28.19,22.9 28.19,38.77 27.9,39.07 v4(26.67,39.07) 26.67,39.07 U1.22
M0_IN1: length 26.1
  Top Layer w0.254: U1.27 29.34,42.32 30.73,40.93 30.73,22.9 H13.8
M0_IN2: length 23.4
  Top Layer w0.254: U1.25 29.12,41.02 29.84,40.3 v4(29.84,24.17)
  Bottom Layer w0.254: v4(29.84,24.17) H13.10
M0_IN3: length 19.8
  Top Layer w0.254: U1.23 28.26,39.72 28.96,39.02 v4(28.96,26.58)
  Bottom Layer w0.254: v4(28.96,26.58) 31.88,26.58 H13.12
M0_OUT1_CS: length 57.4
  Bottom Layer w0.254: H13.2 18.03,14.01 8.89,23.15 8.89,47.66 9.65,48.42 12.06,48.42 12.83,47.66 12.83,46.31 U6.8
M0_OUT1_N: length 2.2
  Bottom Layer w0.254: v4(10.33,39.15) 11.18,39.15 11.49,39.46 U6.3
M0_OUT1_P: length 2.2
  Bottom Layer w0.254: v4(13.29,39.15) 12.45,39.15 12.14,39.46 U6.2
M0_OUT2_CS: length 27.7
  Bottom Layer w0.254: H13.4 18.67,16.55 10.8,24.42 10.8,27.55 U7.8
M0_OUT2_N: length 2.1
  Bottom Layer w0.254: v4(10.33,34.67) 10.96,34.67 11.49,34.14 U7.2
M0_OUT2_P: length 2.1
  Bottom Layer w0.254: v4(13.29,34.67) 12.66,34.67 12.14,34.14 U7.3
MCU_3V3: length 5
  Top Layer w0.254: H14.1 H10.1
MCU_3V3_1: length 5
  Top Layer w0.254: H2.18 H15.18
MCU_5V: length 5
  Top Layer w0.254: H2.20 H15.20
NRST: length 5
  Top Layer w0.254: H2.5 H15.5
PA0: length 5
  Top Layer w0.254: H2.6 H15.6
PA1: length 68.7
  Top Layer w0.254: H15.7 H2.7 81.15,36.74 81.15,29.76 70.35,18.96 39.5,18.96 H13.1
PA2: length 71.2
  Top Layer w0.254: H15.8 H2.8 81.41,41.82 80.77,41.18 80.77,29.89 70.2,19.31 37.31,19.31 H13.3
PA3: length 5
  Top Layer w0.254: H2.9 H15.9
PA4: length 5
  Top Layer w0.254: H2.10 H15.10
PA5: length 5
  Bottom Layer w0.254: H2.11 H15.11
PA6: length 80.2
  Top Layer w0.254: H2.12 80.9,51.98 79.63,50.71 79.63,29.89 69.76,20.02 37.29,20.02 35.69,21.63 H13.7
  Bottom Layer w0.254: H2.12 H15.12
PA7: length 83.8
  Top Layer w0.254: H13.9 35.74,24.17 39.53,20.38 69.62,20.38 78.97,29.73 78.97,53.5 79.99,54.52 H2.13
  Bottom Layer w0.254: H2.13 H15.13
PA8: length 53.5
  Top Layer w0.254: H14.16 H10.16 ; v4(57.28,59.73) 57.28,47.79 41.28,31.79 H13.15
  Bottom Layer w0.254: 63.46,62.27 59.82,62.27 v4(57.28,59.73)
PA9: length 73.7
  Top Layer w0.254: 68.46,59.6 63.46,59.6
  Bottom Layer w0.254: 63.46,59.6 62.99,59.6 58.04,54.65 58.04,44.99 52.45,39.41 32.51,39.41 21.73,28.63 v4(21.73,20.18)
PA10: length 82.3
  Top Layer w0.254: H14.14 H10.14
  Bottom Layer w0.254: v4(19.73,20.18) 19.73,27.13 32.38,39.79 52.2,39.79 57.68,45.27 57.68,54.79 57.78,54.9 57.78,55 61.98,59.19 61.98,59.85 62.99,60.87 64.65,60.87 H10.14
PA11: length 5
  Top Layer w0.254: H10.13 H14.13
PA12: length 5
  Top Layer w0.254: H10.12 H14.12
PA15: length 5
  Top Layer w0.254: H14.11 H10.11
PB0: length 86
  Top Layer w0.254: H2.14 81.28,57.06 78.61,54.39 78.61,29.88 69.47,20.74 40.51,20.74 H13.11
  Bottom Layer w0.254: H2.14 H15.14
PB1: length 5
  Bottom Layer w0.254: 83.69,59.6 88.69,59.6
PB2: length 92.7
  Top Layer w0.254: H15.16 H2.16 85.65,60.18 85.65,51.27 85.09,50.71 81.28,50.71 80.26,49.69 80.26,29.88 70.05,19.67 35.13,19.67 H13.5
PB3: length 5
  Top Layer w0.254: H10.10 H14.10
PB4: length 40.2
  Top Layer w0.254: H13.13 40.51,29.25 55.63,44.36 v4(59.18,44.36) ; H14.9 H10.9
  Bottom Layer w0.254: v4(59.18,44.36) H14.9
PB5: length 42.9
  Top Layer w0.254: H10.8 H14.8 61.98,43.31 61.98,66.84 59.56,69.25 55.12,69.25 52.24,72.12 H12.7
PB6: length 47.4
  Top Layer w0.254: H10.7 H14.7 61.62,41.12 61.62,66.52 59.25,68.89 53.24,68.89 H12.6
PB7: length 52.2
  Top Layer w0.254: H10.6 H14.6 61.26,38.94 61.26,66.38 59.17,68.47 51.12,68.47 H12.5
PB8: length 56.9
  Top Layer w0.254: H10.5 H14.5 60.91,36.75 60.91,66.23 59.04,68.09 48.96,68.09 H12.4
PB9: length 61.5
  Top Layer w0.254: 63.46,31.91 60.55,34.82 60.55,65.98 58.79,67.74 48.81,67.74 48.69,67.85 46.78,67.85 42.21,72.43 H12.3 ; 63.46,31.79 H14.4 H10.4
PB10: length 5
  Top Layer w0.254: H2.17 H15.17
PB12: length 111.5
  Top Layer w0.254: H10.20 H14.20 ; SW2.A 47.61,13.5 77.46,13.5 v4(81.01,17.05)
  Bottom Layer w0.254: H10.20 81.01,59.75 v4(81.01,17.05) ; v4(59.69,65.82) 59.69,68.65 63.46,72.43
PB13: length 98.5
  Top Layer w0.254: H10.19 H14.19
  Bottom Layer w0.254: SW2.D 49.11,26.5 54.3,26.5 56.39,24.42 56.39,21.88 63.25,15.02 66.79,15.02 v4(68.82,17.05) 70.99,19.23 70.99,67.6 68.83,69.76 H10.19 ; v4(59.69,64.81) 59.69,65 60.27,65.58 60.27,66.7 63.46,69.89
PB14: length 94
  Top Layer w0.254: H14.18 H10.18 71.5,67.22 v4(72.01,66.71) ; SW2.B 55.22,15.65 v4(56.63,17.05)
  Bottom Layer w0.254: 63.32,67.22 H14.18 ; v4(56.63,17.05) 59.3,14.39 75.06,14.39 75.24,14.57 75.24,63.48 v4(72.01,66.71) ; v4(59.69,63.71) 63.32,67.35
PB15: length 5
  Top Layer w0.254: H10.17 H14.17
PC13: length 5
  Top Layer w0.254: H2.2 H15.2
PC14: length 5
  Top Layer w0.254: H2.3 H15.3
PC15: length 5
  Top Layer w0.254: H2.4 H15.4
$1N2058: length 4.4
  Top Layer w0.254: 23.02,32.55 C4.2
  Top Layer w0.508: U1.17 U1.16 U1.15 23.02,32.55
$1N2061: length 2
  Top Layer w0.254: U1.1 19.24,42.99 C2.2
$1N2062: length 3.6
  Top Layer w0.254: C2.1 20.4,44.69 20.4,42.78 19.94,42.32 U1.2
$1N2063: length 4.3
  Top Layer w0.254: U1.3 18.31,41.67 18.03,41.95 18.03,43.6 17.21,44.42 C3.2
$1N2072: length 2
  Top Layer w0.254: U1.18 26.67,36.47 R1.1
$1N2073: length 2.2
  Top Layer w0.254: R1.2 26.92,32.56 LED1.2
$1N2080: length 1.9
  Top Layer w0.254: R20.2 LED4.2
$1N2087: length 1.5
  Top Layer w0.254: C29.1 44.2,58.98 U11.1
$1N2088: length 7.2
  Top Layer w0.254: R22.2 42.54,63.54 43.29,62.79 U11.4 44.85,62.79 46.74,64.68 R21.1
$1N2099: length 1.9
  Top Layer w0.254: 4.69,52.75 4.69,52.74 LED6.2
$1N2103: length 1.9
  Top Layer w0.254: R24.2 2.76,50.2
$1N3381: length 13
  Top Layer w0.203: Q1.1 2.06,62.36 2.99,63.28 6.52,63.28 7.33,62.47 R25.1
  Top Layer w0.254: 5.09,57.39 6.25,57.39 C36.2 R25.1

## Copper pours and planes (outline as drawn; the poured copper is in the pictures)
GND on Top Layer: 30.99,73.82 91.95,88.94 92.96,-2.63 30.99,11.85
GND on Bottom Layer: 30.82,73.72 92.07,88.68 92.71,-3.27 89.15,-1.49 31.2,11.87 30.82,12.25
PGND on Top Layer: -2.92,92.36 -2.67,72.81 -2.67,-6.23 30.73,11.85 30.73,73.57
PGND on Bottom Layer: -2.92,92.36 -2.86,72.62 -2.67,-5.88 30.54,11.91 30.54,73.63
VCC-3.3V on Top Layer: 43.05,53.25 54.86,53.25 54.86,47.49 43.05,47.49
VCC-3.3V on Bottom Layer: 10.41,47.28 11.68,47.28 11.68,44.99 10.41,44.99
VCC-5V on Top Layer: 48.9,63.35 56.09,63.35 56.09,58.84 48.9,58.84
VCC-5V on Top Layer: 49,59.09 55.37,59.09 55.37,52.11 49,52.11
VIN on Top Layer: 14.48,72.43 40,72.43 40,40.68 14.48,40.68
VIN on Top Layer: 17.81,41.31 20.19,41.31 20.19,40.68 17.81,40.68
VIN on Top Layer: 17.4,36.1 18.16,36.1 18.16,34.33 17.4,34.33
VIN_12V on Top Layer: 5.33,72.39 16,72.39 16,56.55 5.33,56.55
M0_EN on Bottom Layer: 24.27,42.07 27.31,42.07 27.56,41.82 27.56,39.02 27.31,38.77 24,38.77 23.88,38.9 23.88,41.68
M0_OUT1_N on Top Layer: 1.91,41.31 11.25,41.31 11.25,37.12 1.91,37.12
M0_OUT1_P on Top Layer: 12.54,40.55 20.19,40.55 20.19,38.01 12.54,38.01
M0_OUT2_N on Top Layer: 1.91,36.23 11.19,36.23 11.19,32.55 1.91,32.55
M0_OUT2_P on Top Layer: 12.32,38.64 20.19,38.64 20.19,33.44 12.32,33.44
M0_OUT3 on Top Layer: 1.91,38.01 20.19,38.01 20.19,27.59 1.91,27.59
$1N2090 on Top Layer: 0.51,72.39 4.83,72.39 4.83,63.75 0.51,63.75
$1N2090 on Top Layer: 0.51,65.69 3.01,65.69 3.01,58.46 0.51,58.46
$1N2889 on Top Layer: 37.59,63.28 48.51,63.28 48.51,55.41 37.59,55.41

Small or netless copper shapes (teardrops, artwork), in the pictures only: 203 on Top Layer, 78 on Bottom Layer

## Text on the board
Bottom Silkscreen Layer: - | + | ON | OFF | FOC验证板V1.1
Top Silkscreen Layer: VIN | +5V | 3V3 | SCL | SDA | IN3 | IN2 | IN1 | EN | OT2 | OT1 | PA8 | PB4 | PB0 | PA7 | PA6 | PB2 | PA2 | PA1 | PB14 | PB13 | PB12 | JLCJLCJLCJLC | GND | A10 | PA9 | OUT1 | OUT2 | OUT3 | STATE | - | + | ON | OFF
